# EAGLE design Sony_remote (EAGLE 6.2)
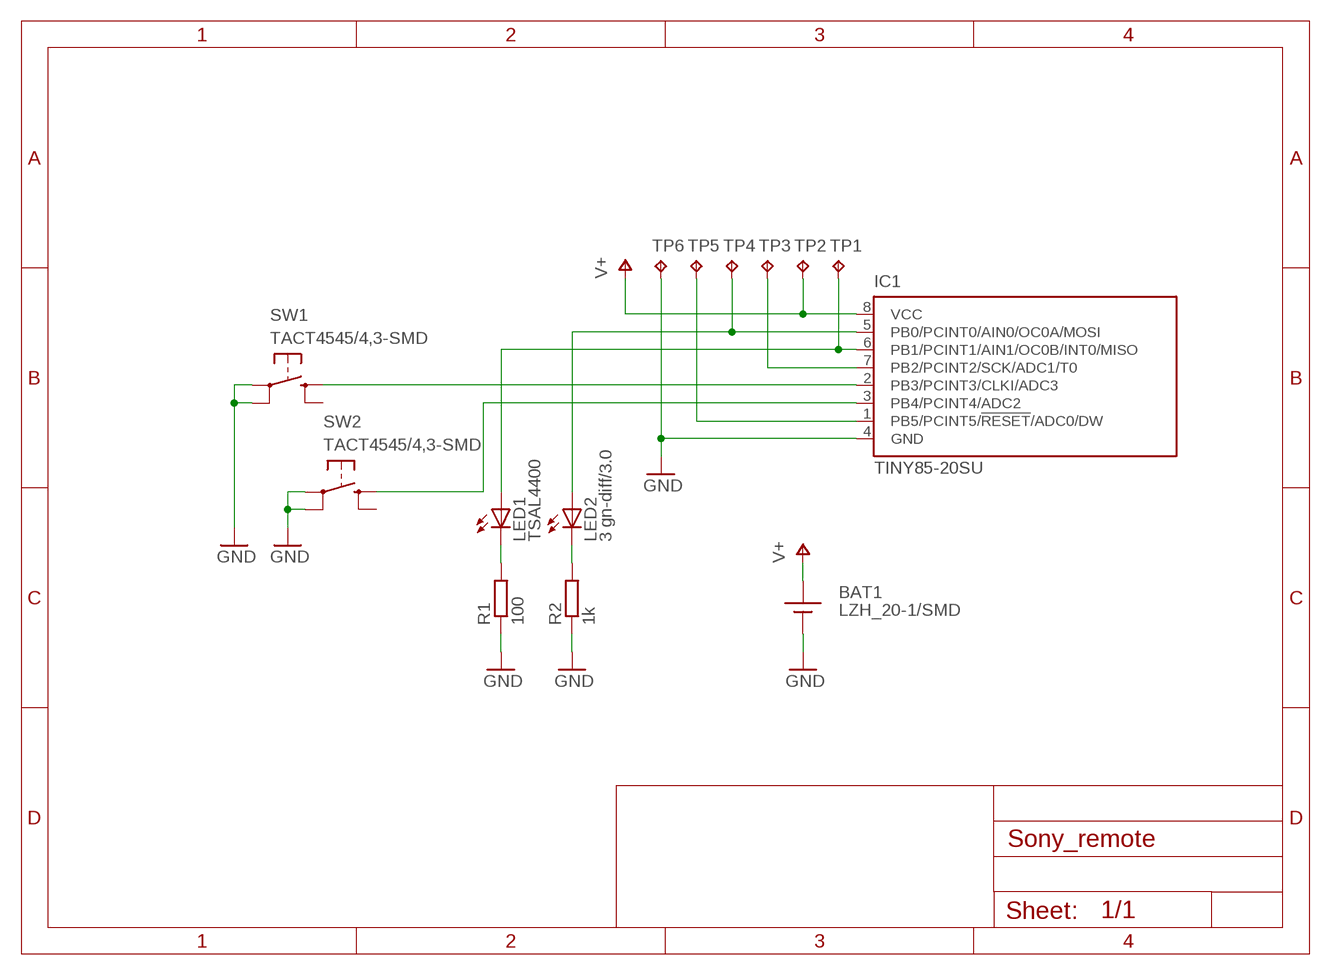
[diagram p0: schematic, sheet 1]

## Parts
BAT1  LZH_20-1/SMD  [LZH_20-1/SMD]
IC1  TINY85-20SU  TINY13-20SU  [8S2]
LED1  TSAL4400  LED3MM  [LED3MM]
LED2  3 gn-diff/3.0  LED3MM  [LED3MM]
R1  100  R-EU_M0805  [M0805]
R2  1k  R-EU_M0805  [M0805]
SW1  TACT4545/4,3-SMD  TACT4545-SMD  [TACT4545-SMD]
SW2  TACT4545/4,3-SMD  TACT4545-SMD  [TACT4545-SMD]
TP1  MISO  TPB1,27  [B1,27]
TP2  VCC  TPB1,27  [B1,27]
TP3  SCK  TPB1,27  [B1,27]
TP4  MOSI  TPB1,27  [B1,27]
TP5  RST  TPB1,27  [B1,27]
TP6  GND  TPB1,27  [B1,27]

## Nets
GND: BAT1.- IC1.4(GND) R1.1 R2.1 SW1.P$1(P) SW1.P$2(P1) SW2.P$1(P) SW2.P$2(P1) TP6.TP
N$1: IC1.2(PB3/PCINT3/CLKI/ADC3) SW1.P$3(S)
N$2: IC1.7(PB2/PCINT2/SCK/ADC1/T0) TP3.TP
N$3: IC1.3(PB4/PCINT4/ADC2) SW2.P$3(S)
N$4: IC1.5(PB0/PCINT0/AIN0/OC0A/MOSI) LED2.A TP4.TP
N$5: IC1.6(PB1/PCINT1/AIN1/OC0B/INT0/MISO) LED1.A TP1.TP
N$6: IC1.1(PB5/PCINT5/!RESET!/ADC0/DW) TP5.TP
N$7: LED1.K(C) R1.2
N$8: LED2.K(C) R2.2
V+: BAT1.+ IC1.8(VCC) TP2.TP
Unconnected: SW1.P$4(S1) SW2.P$4(S1)

## Library data of the parts
BAT1 = Batteriehalter:LZH_20-1/SMD
IC1 = atmel:TINY13: 8-bit AVR Microcontroller with 1K Bytes In-System Programmable Flash Source: http://www.atmel.com/dyn/resources/prod_documents/2535S.pdf; MPN: ATTINY13-20SU; OC_FARNELL: 9171568; OC_NEWARK: 96K6522
LED1 LED2 = led:LED: LED OSRAM: - CHIPLED LG R971, LG N971, LY N971, LG Q971, LY Q971, LO R971, LY R971 LH N974, LH R974 LS Q976, LO Q976, LY Q976 LO Q996 - Hyper CHIPLED LW Q18S LB Q993, LB Q99A, LB R99A - SideLED LS A670, LO A670, LY A670, LG A670, LP A670 LB A673, LV A673, LT A673, LW A673 LH A674 LY A675 LS A676, LA A676, LO A676, LY A676, LW A676 LS A679, LY A679, LG A679 - Hyper Micro SIDELED® LS Y876, LA Y876, LO Y876, LY Y876 LT Y87S - SmartLED LW L88C, LW L88S LB L89C, LB L89S, LG L890 LS L89K, LO L89K, LY L89K LS L896, LA L896, LO L896, LY L896 - TOPLED LS T670, LO T670, LY T670, LG T670, LP T670 LSG T670, LSP T670, LSY T670, LOP T670, LYG T670 LG T671, LOG T671, LSG T671 LB T673, LV T673, LT T673, LW T673 LH T674 LS T676, LA T676, LO T676, LY T676, LB T676, LH T676, LSB T676, LW T676 LB T67C, LV T67C, LT T67C, LS T67K, LO T67K, LY T67K, LW E67C LS E67B, LA E67B, LO E67B, LY E67B, LB E67C, LV E67C, LT E67C LW T67C LS T679, LY T679, LG T679 LS T770, LO T770, LY T770, LG T770, LP T770 LB T773, LV T773, LT T773, LW T773 LH T774 LS E675, LA E675, LY E675, LS T675 LS T776, LA T776, LO T776, LY T776, LB T776 LHGB T686 LT T68C, LB T68C - Hyper Mini TOPLED® LB M676 - Mini TOPLED Santana® LG M470 LS M47K, LO M47K, LY M47K Source: http://www.osram.convergy.de LUXEON: - LUMILED® LXK2-PW12-R00, LXK2-PW12-S00, LXK2-PW14-U00, LXK2-PW14-V00 LXK2-PM12-R00, LXK2-PM12-S00, LXK2-PM14-U00 LXK2-PE12-Q00, LXK2-PE12-R00, LXK2-PE12-S00, LXK2-PE14-T00, LXK2-PE14-U00 LXK2-PB12-K00, LXK2-PB12-L00, LXK2-PB12-M00, LXK2-PB14-N00, LXK2-PB14-P00, LXK2-PB14-Q00 LXK2-PR12-L00, LXK2-PR12-M00, LXK2-PR14-Q00, LXK2-PR14-R00 LXK2-PD12-Q00, LXK2-PD12-R00, LXK2-PD12-S00 LXK2-PH12-R00, LXK2-PH12-S00 LXK2-PL12-P00, LXK2-PL12-Q00, LXK2-PL12-R00 Source: www.luxeon.com KINGBRIGHT: KA-3528ASYC Source: www.kingbright.com
R1 R2 = resistor:R-EU_: RESISTOR, European symbol
SW1 SW2 = TACT:TACT4545-SMD
TP1-TP6 = testpad:TP: Test pad

## Board
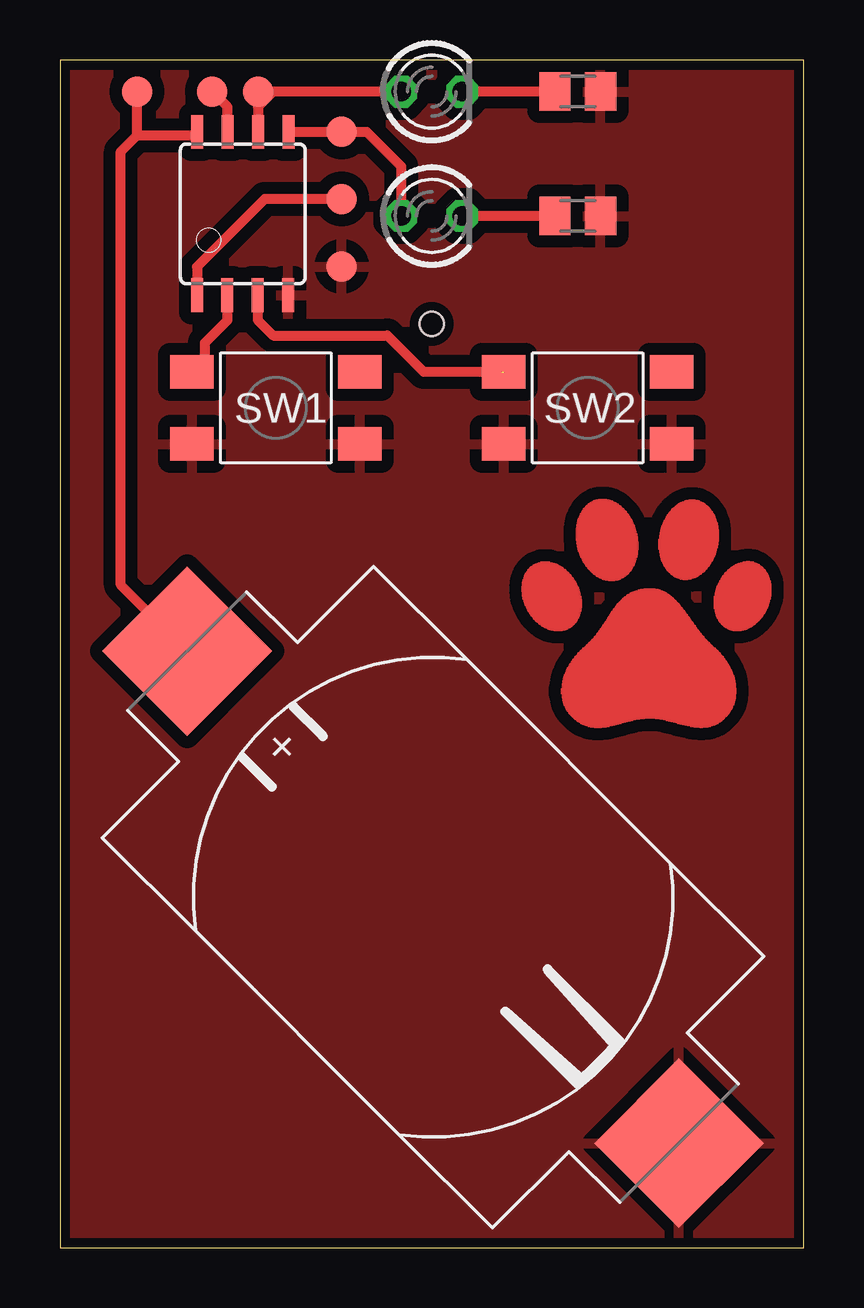
[diagram p1: board, top side]

Size 31 x 49.5 mm. Coordinates in mm from the lower left corner, seen from the top.
Outline: 0,0 31,0 31,49.5 0,49.5 0,0
Copper layers (1*16): Top 0.035mm / dielectric 1.5mm / Bottom 0.035mm
Design rules: minimum track width 10mil, minimum drill 24mil, track to track 20mil, track to pad 20mil, pad to pad 20mil, via to via 20mil, smd to smd 20mil, copper to edge 16mil, drill to drill 8mil, minimum pad ring 10mil, minimum via ring 8mil, stop-mask expansion 4mil, vias tented up to drill 0mil, thermal gap 20mil
Holes 1 mm at 15.5,38.5

### Footprints (pad centres in the part's own frame; a part is rotated, then mirrored left to right if it is on the bottom)
LZH_20-1/SMD = smd 5 x 5: + -14.5,0; - 14.5,0
8S2 = smd 0.5 x 1.4: 1 -1.905,-3.404; 2 -0.645,-3.404; 3 0.625,-3.404; 4 1.895,-3.404; 5 1.905,3.404; 6 0.635,3.404; 7 -0.635,3.404; 8 -1.905,3.404
LED3MM = drill 0.813 octagon: A -1.27,0; K 1.27,0
M0805 = smd 1.3 x 1.6: 1 -0.95,0; 2 0.95,0
TACT4545-SMD = smd 1.8 x 1.4: P$1 -3.5,-1.5; P$2 3.5,-1.5; P$3 -3.5,1.5; P$4 3.5,1.5
B1,27 = smd 1.27 x 1.27: TP 0,0

### Placement (x,y rotation side)
BAT1  15.56,14.61 315 top
IC1  7.62,43.1 0 top
LED1  15.5,48.18 0 top
LED2  15.5,43 0 top
R1  21.59,48.18 180 top
R2  21.59,43 180 top
SW1  9,35 0 top
SW2  22,35 0 top
TP1  8.26,48.18 0 top
TP2  3.21,48.18 0 top
TP3  6.35,48.18 0 top
TP4  11.75,46.51 0 top
TP5  11.75,43.7 0 top
TP6  11.75,40.9 0 top

### Tracks (layer width: path | path; a pad name or v marks a point on that pad's centre or on a via)
GND
  pour Top: 0,0 0,49.5 31,49.5 31,0
N$1
  Top 0.406: IC1.2 6.97,38.65 6.03,37.7 6.03,37.03 SW1.P$3
N$2
  Top 0.406: IC1.7 6.99,47.55 TP3.TP
N$3  (1 unrouted)
  Top 0.406: IC1.3 8.24,38.66 8.89,38.02 13.65,38.02 15.17,36.5 18.4,36.5
N$4
  Top 0.406: IC1.5 TP4.TP 12.79,46.5 14.23,45.06 LED2.A
  Top 0.5: TP4.TP
N$5
  Top 0.406: LED1.A 8.89,48.18 8.57,47.86 | 8.57,47.86 8.26,47.55 IC1.6 | TP1.TP 8.57,47.86
N$6
  Top 0.406: IC1.1 5.71,40.88 8.54,43.7 TP5.TP
N$7
  Top 0.406: R1.2 LED1.K
N$8
  Top 0.406: R2.2 LED2.K
V+
  Top 0.406: BAT1.+ 2.54,27.62 2.54,45.69 3.21,46.35 | 3.21,46.35 TP2.TP | 3.21,46.35 5.57,46.35 IC1.8
(copper drawn outside any net)
  shapes: Top area x741

### Text on the board
tValues: K | K